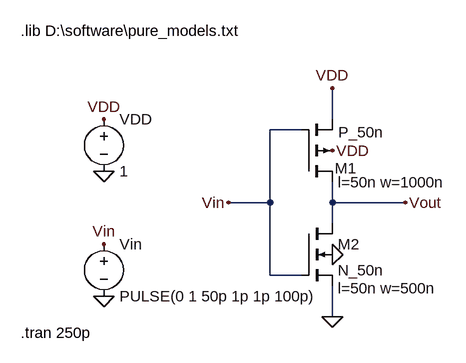
[diagram p0: schematic lab3b.asc]
lab3b.asc, the LTspice schematic file:
Version 4
SHEET 1 880 680
WIRE 192 64 192 16
WIRE 144 80 96 80
WIRE 96 192 96 80
WIRE 96 192 32 192
WIRE 192 192 192 160
WIRE 304 192 192 192
WIRE 192 224 192 192
WIRE 96 304 96 192
WIRE 144 304 96 304
WIRE 192 368 192 320
FLAG 192 368 0
FLAG 192 272 0
FLAG -160 144 0
FLAG -160 336 0
FLAG -160 64 VDD
FLAG 192 16 VDD
FLAG 304 192 Vout
FLAG 32 192 Vin
FLAG -160 256 Vin
FLAG 192 112 VDD
SYMBOL pmos4 144 160 M180
WINDOW 0 52 21 Left 2
WINDOW 3 57 76 Left 2
WINDOW 123 56 -1 Left 2
SYMATTR InstName M1
SYMATTR Value P_50n
SYMATTR Value2 l=50n w=1000n
SYMBOL nmos4 144 224 R0
WINDOW 123 56 100 Left 2
SYMATTR Value2 l=50n w=500n
SYMATTR InstName M2
SYMATTR Value N_50n
SYMBOL voltage -160 48 R0
WINDOW 123 0 0 Left 0
WINDOW 39 0 0 Left 0
SYMATTR InstName VDD
SYMATTR Value 1
SYMBOL voltage -160 240 R0
WINDOW 123 0 0 Left 0
WINDOW 39 0 0 Left 0
SYMATTR InstName Vin
SYMATTR Value PULSE(0 1 50p 1p 1p 100p)
TEXT -288 -72 Left 2 !.lib D:\\software\\pure_models.txt
TEXT -288 392 Left 2 !.tran 250p

The netlist it stands for:
* lab3b.asc
M1 Vout Vin VDD VDD P_50n l=50n w=1000n
M2 Vout Vin 0 0 N_50n l=50n w=500n
VDD VDD 0 1
Vin Vin 0 PULSE(0 1 50p 1p 1p 100p)
.model NMOS NMOS
.model PMOS PMOS
.lib standard.mos
.lib D:\software\pure_models.txt
.tran 250p
.backanno
.end

* Results of the author's LTspice run, read from the files saved beside the schematic
* Operating Point, zero values left out:
*   V(vout) = 1 V
*   V(vdd) = 1 V
*   Id(M1) = -3.645 nA
*   Ig(M1) = -17.57 nA
*   Ib(M1) = 139.3 pA
*   Is(M1) = 21.07 nA
*   Id(M2) = 3.643 nA
*   Ig(M2) = -620.9 pA
*   Ib(M2) = -1 pA
*   Is(M2) = -3.021 nA
*   I(Vdd) = -21.21 nA
*   I(Vin) = 18.19 nA
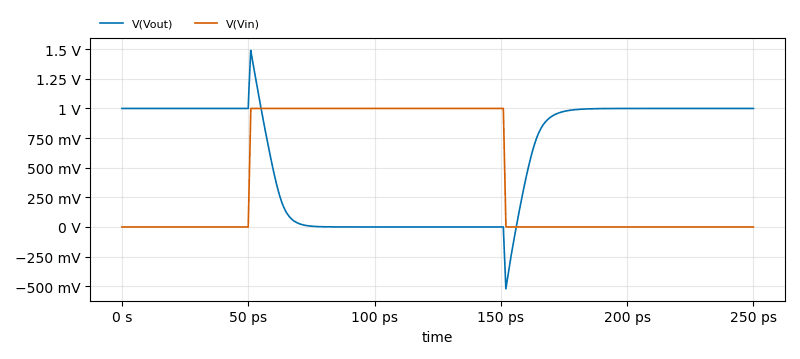
[diagram p1: Transient Analysis of lab3b.asc, plotted from the saved traces]
* Transient Analysis, 1 run:
*   V(Vout): min -521.7 mV, max 1.49 V, average 593.7 mV, rms 767 mV, last 1 V
*   V(Vin): min 0 V, max 1 V, average 404 mV, rms 634.6 mV, last 0 V